# EAGLE design PCB-MicroSmartV (EAGLE 7.5.0)
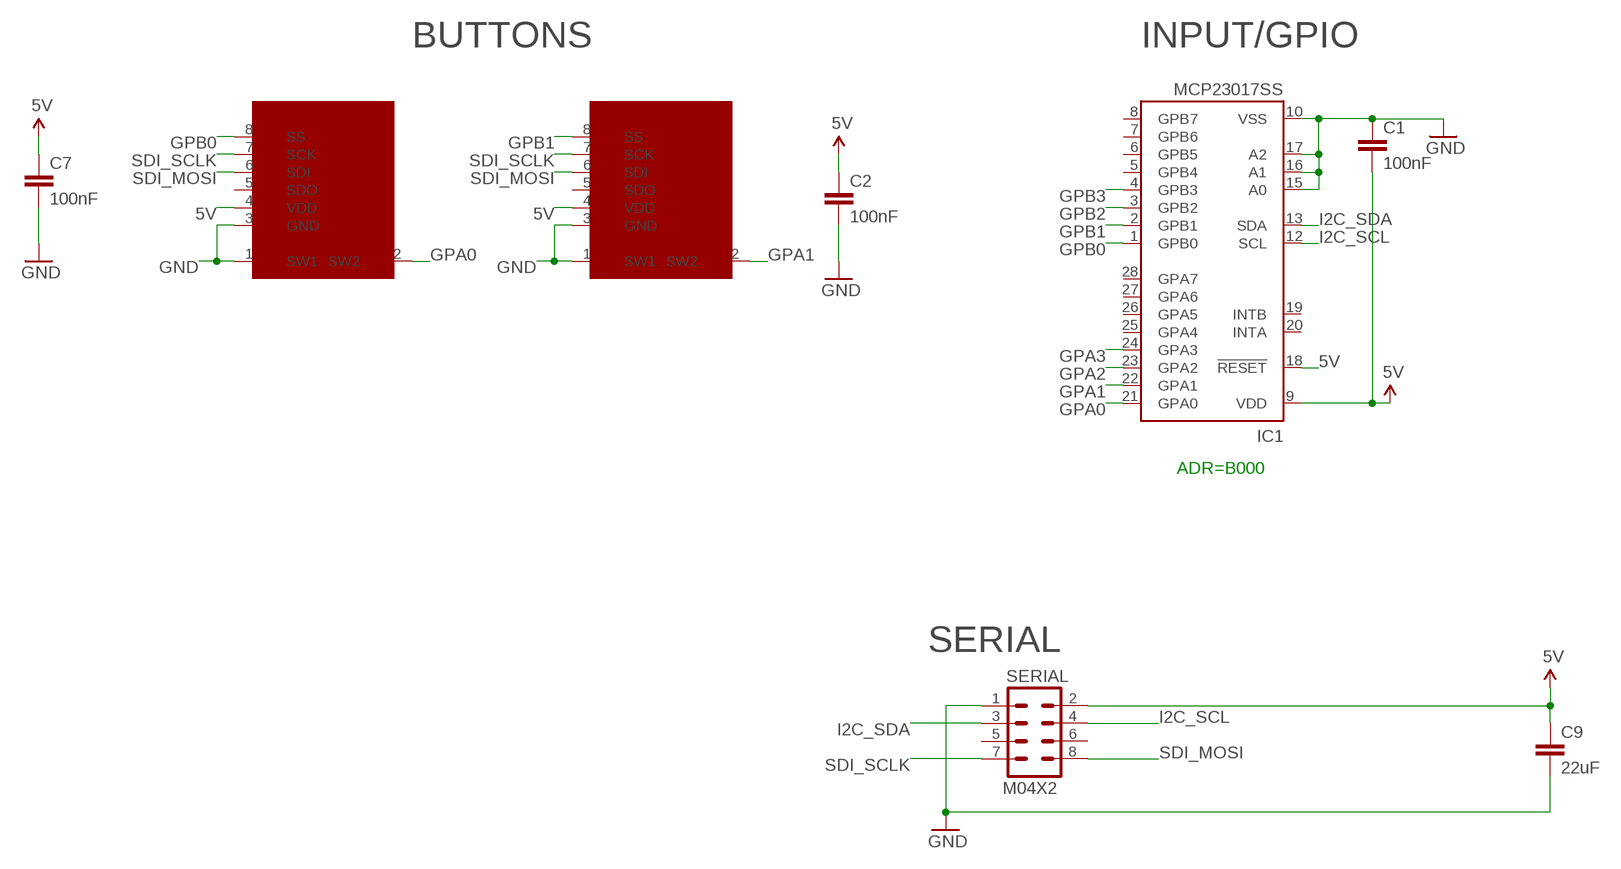
[diagram p0: schematic, sheet 1]

## Parts
C1  100nF  CAP0603-CAP  [0603-CAP]
C2  100nF  CAP0603-CAP  [0603-CAP]
C7  100nF  CAP0603-CAP  [0603-CAP]
C9  22uF  CAP0805  [0805]
IC1  MCP23017SS  [SSOP28]
SERIAL  M04X2  [2X4]
SSW1  SMART_SWITCHSMART_SWITCH_8PIN  [SMART_SWITCH]
SSW2  SMART_SWITCHSMART_SWITCH_8PIN  [SMART_SWITCH]

## Nets
5V [Power]: C1.2 C2.1 C7.1 C9.1 IC1.9(VDD) IC1.18(!RESET) SERIAL.2 SSW1.4(VDD) SSW2.4(VDD)
GND [Power]: C1.1 C2.2 C7.2 C9.2 IC1.10(VSS) IC1.15(A0) IC1.16(A1) IC1.17(A2) SERIAL.1 SSW1.1(SW1) SSW1.3(GND) SSW2.1(SW1) SSW2.3(GND)
GPA0: IC1.21(GPA0) SSW1.2(SW2)
GPA1: IC1.22(GPA1) SSW2.2(SW2)
GPA2: IC1.23(GPA2)
GPA3: IC1.24(GPA3)
GPB0: IC1.1(GPB0) SSW1.8(SS)
GPB1: IC1.2(GPB1) SSW2.8(SS)
GPB2: IC1.3(GPB2)
GPB3: IC1.4(GPB3)
I2C_SCL: IC1.12(SCL) SERIAL.4
I2C_SDA: IC1.13(SDA) SERIAL.3
SDI_MOSI: SERIAL.8 SSW1.6(SDI) SSW2.6(SDI)
SDI_SCLK: SERIAL.7 SSW1.7(SCK) SSW2.7(SCK)
Unconnected: IC1.5(GPB4) IC1.6(GPB5) IC1.7(GPB6) IC1.8(GPB7) IC1.19(INTB) IC1.20(INTA) IC1.25(GPA4) IC1.26(GPA5) IC1.27(GPA6) IC1.28(GPA7) SERIAL.5 SERIAL.6 SSW1.5(SDO) SSW2.5(SDO)

## Notes on the sheet
- BUTTONS | INPUT/GPIO
- ADR=B000
- SERIAL

## Library data of the parts
C1 C2 C7 C9 = SparkFun:CAP: Capacitor Standard 0603 ceramic capacitor, and 0.1" leaded capacitor.
IC1 = microchip:MCP23017: http://ww1.microchip.com/downloads/en/DeviceDoc/21952a.pdf Source: http://ww1.microchip.com/downloads/en/DeviceDoc/21952a.pdf; MF: MICROCHIP; MPN: MCP23017-E/SS; OC_FARNELL: 1467674; OC_NEWARK: 31K2960
SERIAL = SparkFun:M04X2
SSW1 SSW2 = SKAARHOJ:SMART_SWITCH: SMARTSWITCH IS15DSBFP4RGB www.nkksmartswitch.com

## Net classes
0 default: width 0.203 mm, drill 0.406 mm, clearance 0.203 mm
1 Power: width 0.406 mm, drill 0.61 mm, clearance 0.203 mm

## Board
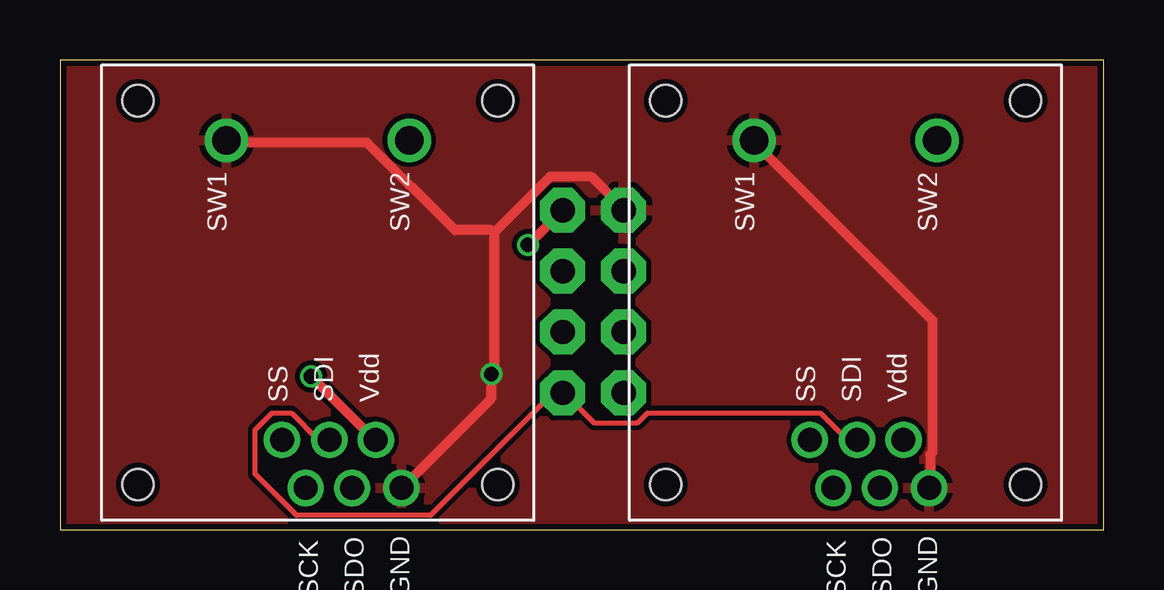
[diagram p1: board, top side]
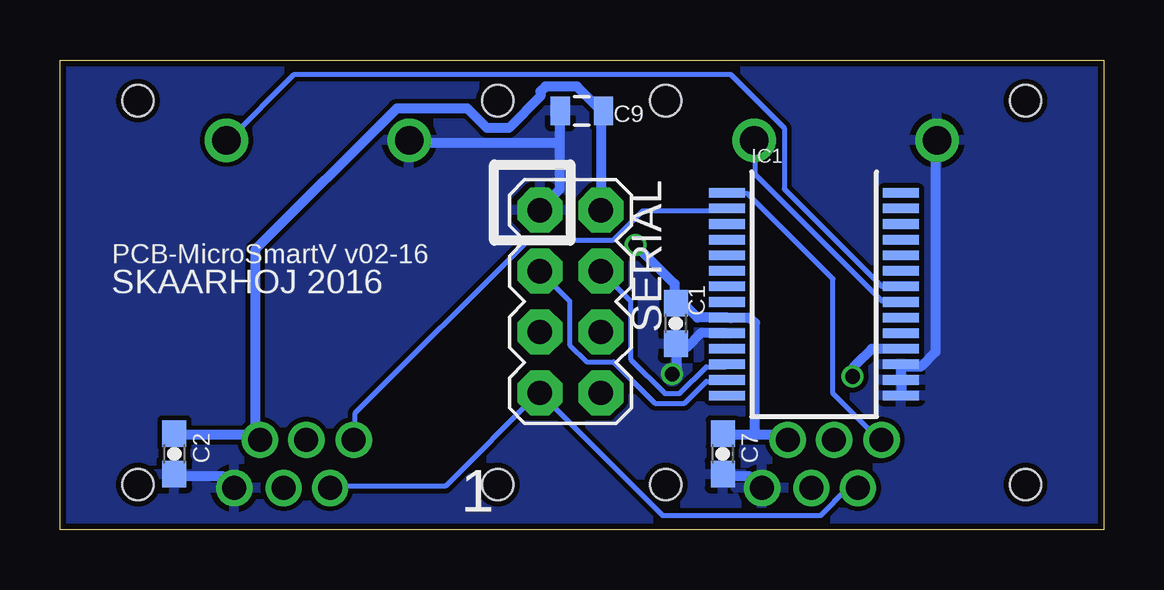
[diagram p2: board, bottom side, seen from below]

Size 43.5 x 19.6 mm. Coordinates in mm from the lower left corner, seen from the top.
Outline: 0,0 43.5,0 43.5,19.6 0,19.6 0,0
Copper layers (1*16): Top 0.035mm / dielectric 1.5mm / Bottom 0.035mm
Design rules "Fusion_eagle_rule_v1.1": minimum track width 6mil, minimum drill 12mil, track to track 6mil, track to pad 6mil, pad to pad 6mil, via to via 6mil, smd to smd 0mil, copper to edge 10mil, drill to drill 10mil, minimum pad ring 10mil, minimum via ring 6mil, stop-mask expansion 2mil, vias tented up to drill 100mil, thermal gap 10mil

### Footprints (pad centres in the part's own frame; a part is rotated, then mirrored left to right if it is on the bottom)
0603-CAP = smd 1.1 x 1: 1 -0.85,0; 2 0.85,0
0805 = smd 0.8 x 1.2: 1 -0.9,0; 2 0.9,0
SSOP28 = smd 0.4 x 1.5: 1 -4.225,-3.625; 2 -3.575,-3.625; 3 -2.925,-3.625; 4 -2.275,-3.625; 5 -1.625,-3.625; 6 -0.975,-3.625; 7 -0.325,-3.625; 8 0.325,-3.625; 9 0.975,-3.625; 10 1.625,-3.625; 11 2.275,-3.625; 12 2.925,-3.625; 13 3.575,-3.625; 14 4.225,-3.625; 15 4.225,3.625; 16 3.575,3.625; 17 2.925,3.625; 18 2.275,3.625; 19 1.625,3.625; 20 0.975,3.625; 21 0.325,3.625; 22 -0.325,3.625; 23 -0.975,3.625; 24 -1.625,3.625; 25 -2.275,3.625; 26 -2.925,3.625; 27 -3.575,3.625; 28 -4.225,3.625
2X4 = drill 1.016 pad 1.88 octagon: 1 -3.81,-1.27; 2 -3.81,1.27; 3 -1.27,-1.27; 4 -1.27,1.27; 5 1.27,-1.27; 6 1.27,1.27; 7 3.81,-1.27; 8 3.81,1.27
SMART_SWITCH = drill 1.2: 1 6.35,3.81; 2 6.35,-3.81 | drill 1: 3 -8.153,-3.48; 4 -6.147,-2.413; 5 -8.153,-1.422; 6 -6.147,-0.483; 7 -8.153,0.508; 8 -6.147,1.499 | hole 1.3: -8.001,7.506; 8.001,7.506; 8.001,-7.506; -8.001,-7.506

### Placement (x,y rotation side)
C1  17.83,8.61 90 bottom
C2  38.73,3.17 270 bottom
C7  15.88,3.17 270 bottom
C9  21.74,17.48 180 bottom
IC1  12.06,9.83 270 bottom
SERIAL  22.23,9.53 270 bottom
SSW1  10.75,9.9 90 top
SSW2  32.75,9.9 90 top

### Tracks (layer width: path | path; a pad name or v marks a point on that pad's centre or on a via)
5V  (via drill 0.61)
  Top 0.406: v10.46,6.4 13.11,3.76 SSW1.4 | SERIAL.2 v19.51,11.89
  Bottom 0.406: IC1.18 9.67,7.55 10.36,6.86 10.46,6.71 v10.46,6.4 | 14.53,3.96 13.41,3.96 13.21,3.76 SSW1.4 | 14.53,3.96 15.85,3.96 C7.1 | 14.53,3.96 14.53,8.64 14.73,8.84 15.54,8.84 IC1.9 16.93,8.86 17.37,9.3 17.67,9.3 C1.2 17.88,9.65 17.88,10.26 v19.51,11.89 | C2.1 38.71,3.96 35.46,3.96 35.26,3.76 SSW2.4 35.36,4.06 35.36,11.68 29.46,17.58 26.52,17.58 25.7,16.76 24.79,16.76 23.47,18.09 23.47,18.29 23.27,18.49 21.95,18.49 21.03,17.58 C9.1 20.93,17.48 20.93,13.41 SERIAL.2
GND  (via drill 0.61)
  Top 0.406: SSW1.3 14.33,1.83 17.98,5.49 v17.98,6.5 18.09,6.6 18.09,12.39 | SSW2.3 36.27,1.83 36.27,3.15 36.37,3.25 36.37,8.74 28.96,16.15 SSW2.1 | 18.09,12.39 20.42,14.73 22.15,14.73 23.47,13.41 SERIAL.1 | SSW1.1 7.01,16.15 12.8,16.15 16.46,12.5 17.98,12.5 18.09,12.39
  Bottom 0.406: IC1.10 16.79,8.21 17.37,7.62 17.69,7.62 C1.1 17.78,7.52 17.78,6.71 v17.98,6.5 | IC1.15 8.43,5.69 8.43,6.2 IC1.16 8.43,6.4 8.43,6.81 IC1.17 8.23,6.81 7.62,6.81 7.01,7.42 7.01,16.15 SSW1.1 | C7.2 15.85,2.23 14.73,2.23 14.33,1.83 SSW1.3 | 22.66,16.15 22.66,14.22 23.47,13.41 SERIAL.1 | 22.66,16.15 22.66,17.48 C9.2 | C2.2 38.71,2.23 36.68,2.23 36.27,1.83 SSW2.3 | 22.66,16.15 28.85,16.15 SSW2.1
  pour Top: 0,0 43.18,0 43.18,19.68 0,19.68
  pour Bottom: 0,0 43.18,0 43.18,19.68 0,19.68
GPA0
  Bottom 0.203: IC1.21 8.53,9.55 9.25,9.55 14.53,14.83 14.53,16.15 SSW1.2
GPA1
  Bottom 0.203: IC1.22 8.53,10.16 9.25,10.16 13.31,14.22 13.31,16.76 15.54,19 33.73,19 36.47,16.26 SSW2.2
GPB0
  Bottom 0.203: IC1.1 15.65,14.02 14.83,14.02 11.28,10.46 11.28,5.69 9.35,3.76 SSW1.8
GPB1
  Bottom 0.203: IC1.2 15.75,13.31 19.2,13.31 20.42,12.09 23.98,12.09 31.19,4.88 31.19,3.76 SSW2.8
I2C_SCL
  Bottom 0.203: SERIAL.4 19.71,9.55 19.71,7.11 18.29,5.69 17.68,5.69 16.56,6.81 15.75,6.81 IC1.12
I2C_SDA
  Bottom 0.203: SERIAL.3 22.25,9.55 22.25,7.72 21.54,7.01 20.42,7.01 18.69,5.28 17.48,5.28 16.56,6.2 15.75,6.2 IC1.13
SDI_MOSI
  Top 0.203: SSW1.6 11.18,3.76 10.77,3.76 9.65,4.88 8.84,4.88 8.13,4.17 8.13,2.34 9.86,0.61 15.44,0.61 20.52,5.69 20.93,5.69 SERIAL.8 21.03,5.69 22.25,4.47 24.08,4.47 24.49,4.88 31.7,4.88 32.82,3.76 SSW2.6
SDI_SCLK
  Bottom 0.203: SSW1.7 10.26,1.73 10.67,1.73 11.79,0.61 18.39,0.61 SERIAL.7 23.57,5.69 27.43,1.83 32.21,1.83 SSW2.7

### Text on the board
_bsilk: PCB-MicroSmartV v02-16 | SKAARHOJ 2016 | 1